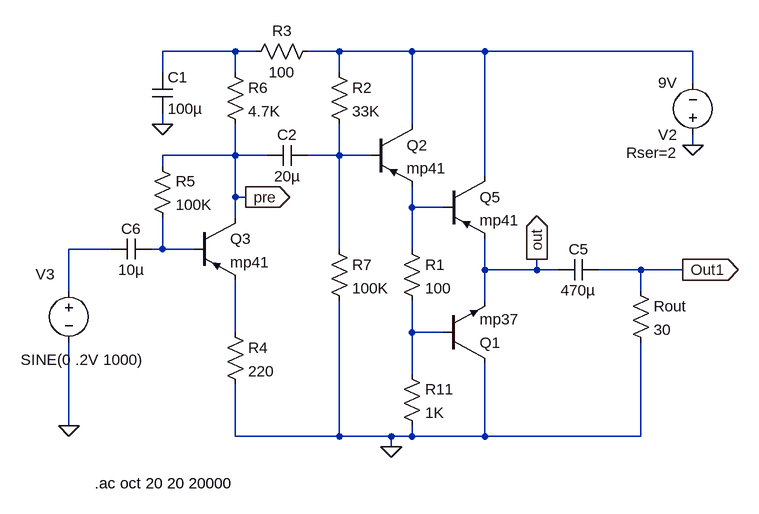
[diagram p0: schematic headamp2.asc]
headamp2.asc, the LTspice schematic file:
Version 4
SHEET 1 880 680
WIRE -368 -912 -480 -912
WIRE -336 -912 -368 -912
WIRE -208 -912 -256 -912
WIRE -96 -912 -208 -912
WIRE 16 -912 -96 -912
WIRE 336 -912 16 -912
WIRE -480 -880 -480 -912
WIRE -368 -880 -368 -912
WIRE -208 -880 -208 -912
WIRE 336 -864 336 -912
WIRE -480 -800 -480 -816
WIRE -96 -800 -96 -912
WIRE 336 -768 336 -784
WIRE -368 -752 -368 -800
WIRE -368 -752 -480 -752
WIRE -320 -752 -368 -752
WIRE -208 -752 -208 -800
WIRE -208 -752 -256 -752
WIRE -160 -752 -208 -752
WIRE -480 -736 -480 -752
WIRE 16 -720 16 -912
WIRE -368 -688 -368 -752
WIRE -352 -688 -368 -688
WIRE -96 -672 -96 -704
WIRE -48 -672 -96 -672
WIRE -368 -656 -368 -688
WIRE -560 -608 -624 -608
WIRE -480 -608 -480 -656
WIRE -480 -608 -496 -608
WIRE -432 -608 -480 -608
WIRE -208 -608 -208 -752
WIRE -96 -608 -96 -672
WIRE 16 -576 16 -624
WIRE 96 -576 96 -592
WIRE 96 -576 16 -576
WIRE 128 -576 96 -576
WIRE 256 -576 192 -576
WIRE 320 -576 256 -576
WIRE -624 -544 -624 -608
WIRE 256 -544 256 -576
WIRE 16 -528 16 -576
WIRE -368 -480 -368 -560
WIRE -96 -480 -96 -528
WIRE -48 -480 -96 -480
WIRE -96 -416 -96 -480
WIRE -624 -336 -624 -464
WIRE -368 -320 -368 -400
WIRE -208 -320 -208 -528
WIRE -208 -320 -368 -320
WIRE -128 -320 -208 -320
WIRE -96 -320 -96 -336
WIRE -96 -320 -128 -320
WIRE 16 -320 16 -432
WIRE 16 -320 -96 -320
WIRE 256 -320 256 -464
WIRE 256 -320 16 -320
WIRE -128 -304 -128 -320
FLAG 336 -768 0
FLAG -128 -304 0
FLAG 320 -576 Out1
IOPIN 320 -576 Out
FLAG -624 -336 0
FLAG -352 -688 pre
IOPIN -352 -688 Out
FLAG 96 -592 out
IOPIN 96 -592 Out
FLAG -480 -800 0
SYMBOL voltage 336 -768 R180
WINDOW 123 0 0 Left 2
WINDOW 39 24 -12 Left 2
SYMATTR SpiceLine Rser=2
SYMATTR InstName V2
SYMATTR Value 9V
SYMBOL pnp -48 -720 R0
SYMATTR InstName Q5
SYMATTR Value mp41
SYMBOL cap 192 -592 R90
WINDOW 0 0 32 VBottom 2
WINDOW 3 32 32 VTop 2
SYMATTR InstName C5
SYMATTR Value 470µ
SYMBOL res -112 -432 R0
SYMATTR InstName R11
SYMATTR Value 1K
SYMBOL cap -496 -624 R90
WINDOW 0 0 32 VBottom 2
WINDOW 3 32 32 VTop 2
SYMATTR InstName C6
SYMATTR Value 10µ
SYMBOL voltage -624 -560 R0
WINDOW 39 -112 95 Left 2
WINDOW 3 -74 122 Left 2
WINDOW 0 -51 -9 Left 2
SYMATTR Value SINE(0 .2V 1000)
SYMATTR InstName V3
SYMATTR Value2 AC 1
SYMBOL res 240 -560 R0
SYMATTR InstName Rout
SYMATTR Value 30
SYMBOL npn -48 -432 M180
SYMATTR InstName Q1
SYMATTR Value mp37
SYMBOL res -112 -624 R0
SYMATTR InstName R1
SYMATTR Value 100
SYMBOL pnp -160 -800 R0
SYMATTR InstName Q2
SYMATTR Value mp41
SYMBOL res -224 -896 R0
SYMATTR InstName R2
SYMATTR Value 33K
SYMBOL res -240 -928 R90
WINDOW 0 0 56 VBottom 2
WINDOW 3 32 56 VTop 2
SYMATTR InstName R3
SYMATTR Value 100
SYMBOL cap -320 -768 M90
WINDOW 0 0 32 VBottom 2
WINDOW 3 32 32 VTop 2
SYMATTR InstName C2
SYMATTR Value 20µ
SYMBOL pnp -432 -656 R0
SYMATTR InstName Q3
SYMATTR Value mp41
SYMBOL res -496 -752 R0
SYMATTR InstName R5
SYMATTR Value 100K
SYMBOL res -384 -896 R0
SYMATTR InstName R6
SYMATTR Value 4.7K
SYMBOL res -384 -496 R0
SYMATTR InstName R4
SYMATTR Value 220
SYMBOL res -224 -624 R0
SYMATTR InstName R7
SYMATTR Value 100K
SYMBOL cap -496 -880 R0
SYMATTR InstName C1
SYMATTR Value 100µ
TEXT -584 -248 Left 2 !.ac oct 20 20 20000

The netlist it stands for:
* headamp2.asc
V2 0 N002 9V Rser=2
Q5 N002 N004 out 0 mp41
C5 Out1 out 470µ
R11 N008 0 1K
C6 N006 N005 10µ
V3 N005 0 SINE(0 .2V 1000) AC 1
Rout Out1 0 30
Q1 0 N008 out 0 mp37
R1 N004 N008 100
Q2 N002 N003 N004 0 mp41
R2 N002 N003 33K
R3 N002 N001 100
C2 pre N003 20µ
Q3 pre N006 N007 0 mp41
R5 pre N006 100K
R6 N001 pre 4.7K
R4 N007 0 220
R7 N003 0 100K
C1 N001 0 100µ
.model NPN NPN
.model PNP PNP
.lib standard.bjt
.ac oct 20 20 20000
.backanno
.end